# Altium schematic sheet Sheet-Battery-V1.0.SchDoc
size A4; SheetNumber: 1; SheetTotal: 1
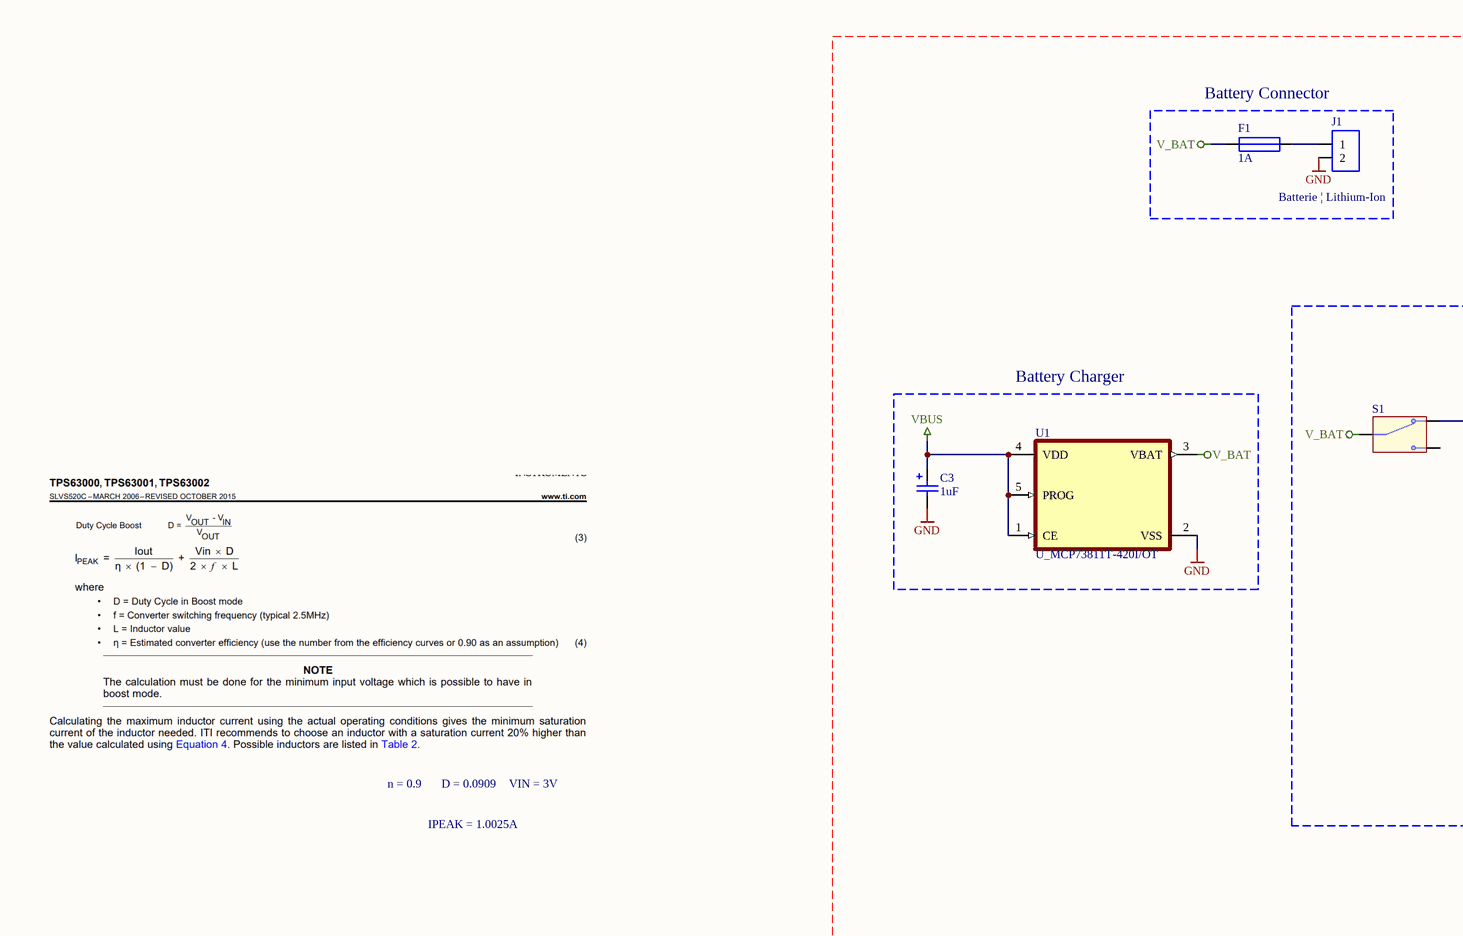
[diagram p0: Sheet-Battery-V1.0.SchDoc, left]
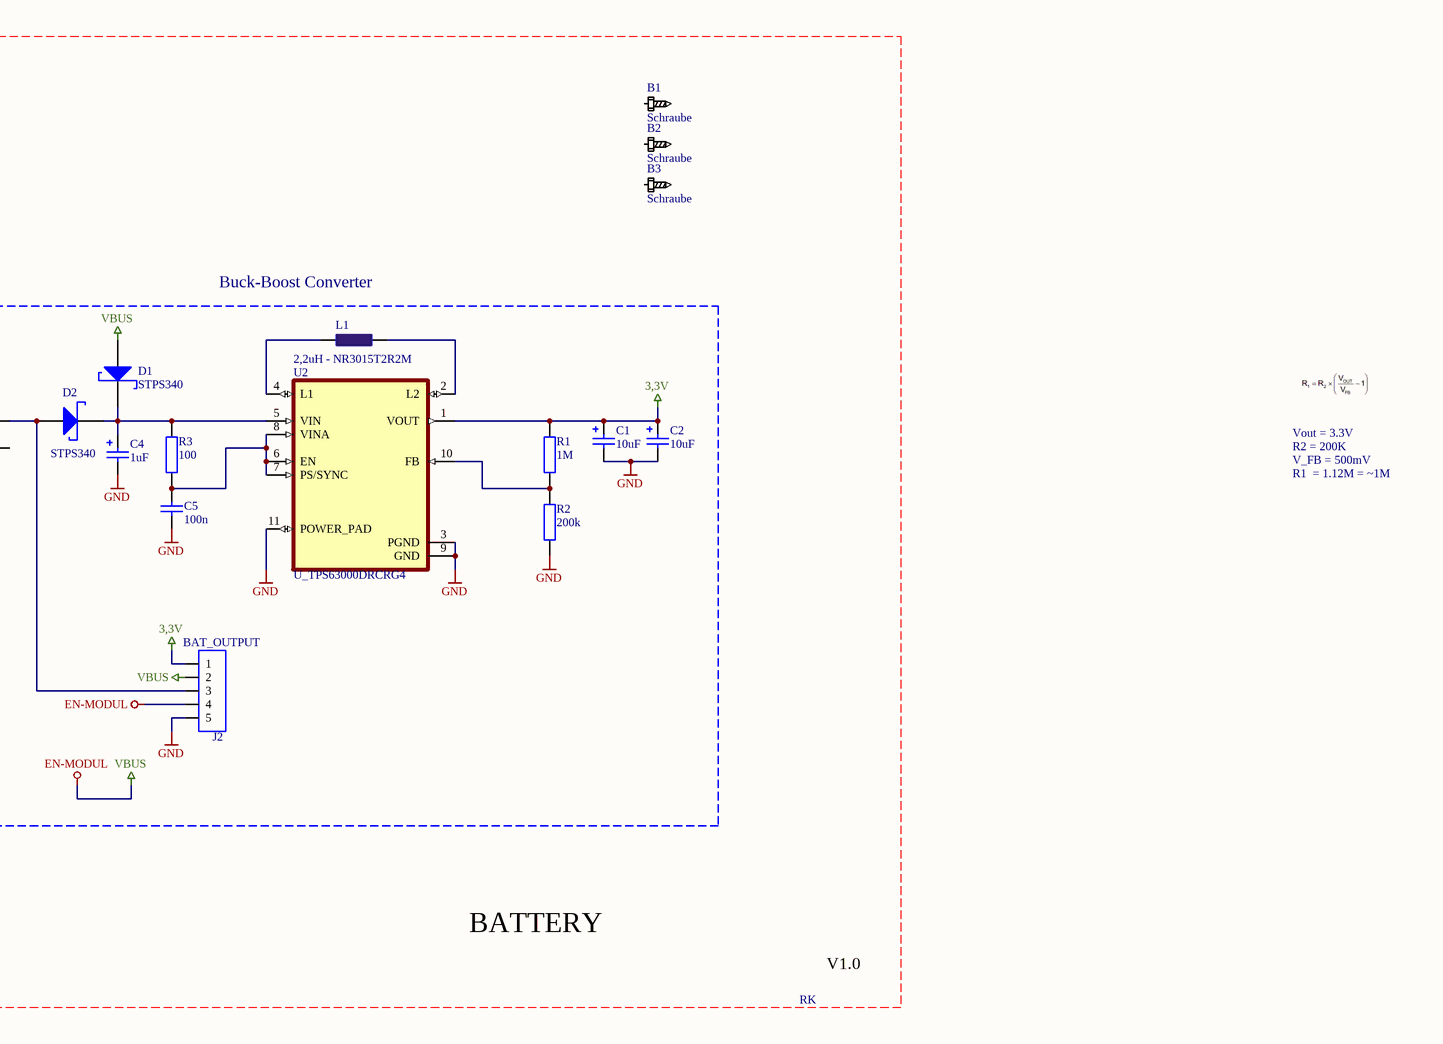
[diagram p1: Sheet-Battery-V1.0.SchDoc, right]

## Parts
B1  Schraube  [B_Schraube-M3 PAD]
B2  Schraube  [B_Schraube-M3 PAD]
B3  Schraube  [B_Schraube-M3 PAD]
C1  10uF  [C_SMD_B-Typ]
C2  10uF  [C_SMD_B-Typ]
C3  1uF  [C_SMD_B-Typ]
C4  1uF  [C_SMD_B-Typ]
C5  100n  [C_SMD_0603]
D1  STPS340  [D_DO-214]
D2  STPS340  [D_DO-214]
F1  1A  [F_OMF63_Schurtner]
J1  Batterie | Lithium-Ion  [J_THT_Printklemme 2x]
J2  BAT_OUTPUT  [SIP-5]
L1  2,2uH - NR3015T2R2M  [L_SMD_ND_NR3015T2R2M]
R1  1M  [R_SMD_0805]
R2  200k  [R_SMD_0805]
R3  100  [R_SMD_0805]
S1  (no value)  [S_THT_SW-3Pol]
U1  U_MCP73811T-420I/OT  [SOT95P280X145-5N]
U2  U_TPS63000DRCRG4  [VREG_V62/16624-01YE]

## Blocks framed on the sheet
Battery Connector: F1 J1
Buck-Boost Converter: C1 C2 C4 C5 D1 D2 J2 L1 R1-R3 S1 U2
Battery Charger: C3 U1

## Nets
3,3V: C1.1 C2.1 J2.1 R1.2 U2.1(VOUT)
EN-MODUL: C3.1 D1.1(A) J2.2 J2.4 U1.1(CE) U1.4(VDD) U1.5(PROG)  [also labelled VBUS]
GND: C1.2 C2.2 C3.2 C4.2 C5.2 J1.2 J2.5 R2.1 U1.2(VSS) U2.3(PGND) U2.9(GND) U2.11(POWER_PAD)
V_BAT: F1.1 S1.2 U1.3(VBAT)
NetC4_1: C4.1 D1.2(K) D2.2(K) R3.2 U2.5(VIN)
NetC5_1: C5.1 R3.1 U2.6(EN) U2.7(PS/SYNC) U2.8(VINA)
NetD2_1: D2.1(A) J2.3 S1.1
NetF1_2: F1.2 J1.1
NetL1_1: L1.1 U2.2(L2)
NetL1_2: L1.2 U2.4(L1)
NetR1_1: R1.1 R2.2 U2.10(FB)

Not connected (* = marked no-connect by the designer): B1 1(PAD); B2 1(PAD); B3 1(PAD); S1 3

## Notes on the sheet
- Vout = 3.3V
- R2 = 200K
- V_FB = 500mV
- R1  = 1.12M = ~1M
- n = 0.9
- D = 0.0909
- VIN = 3V
- IPEAK = 1.0025A
- BATTERY
- V1.0
- RK

## Library data of the parts
B1-B3 = B_Schraube: Schraubenloch für M3 Schrauben
C1-C4 = C_SMD_ELK: SMD Elektrolytkondensator; Spannung: *; Bauform: *; Typ: *
C5 = C_SMD_KO: Kondensator SMD Universal, Keramik, Folie, usw.; Spannung: *; Bauform: *; Typ: *
D1 D2 = D_SMD_Schottky: Diode SMD Schottky; Spannung Rev.: 0,4V; Spannung For.: *; Strom: *
F1 = F_THT_Fuse: Sicherung; Strom: *; Auslösecharakteristik: *
J1 = J_THT_CON2: Stecker
J2 = J_THT_CON5: Stecker
L1 = L_SMD_Spule: Spule SMD
R1-R3 = R_SMD_Widerstand: Widerstand SMD
S1 = S_THT_Schalter 3-Pol.: Toggle Switch; MP: 100SP1T1B4M2QE; Value: *; Availability: Unavailable; Price: None; Package: None
U1 = U_MCP73811T-420I/OT: Charger IC Lithium Ion/Polymer SOT-23-5; MF: Microchip; Availability: In Stock; SnapEDA_Link: https://www.snapeda.com/parts/MCP73811T-420I/OT/Microchip/view-part/?ref=snap; Price: None; Check_prices: https://www.snapeda.com/parts/MCP73811T-420I/OT/Microchip/view-part/?ref=eda; Package: SOT-23 Microchip; MP: MCP73811T-420I/OT; Value: *; Purchase-URL: https://pricing.snapeda.com/search/part/MCP73811T-420I/OT/?ref=eda
U2 = U_TPS63000DRCRG4: High efficiency Buck-Boost Converter with 1.8A Current Switches in 3x3 QFN 10-VSON -40 to 85; MF: Texas Instruments; Price: None; SnapEDA_Link: https://www.snapeda.com/parts/TPS63000DRCRG4/Texas%20Instruments/view-part/287688/?ref=snap; MP: TPS63000DRCRG4; Value: *; Availability: Warning; Package: VSON-10 Texas Instruments; Purchase-URL: https://pricing.snapeda.com/search/part/TPS63000DRCRG4/?ref=eda